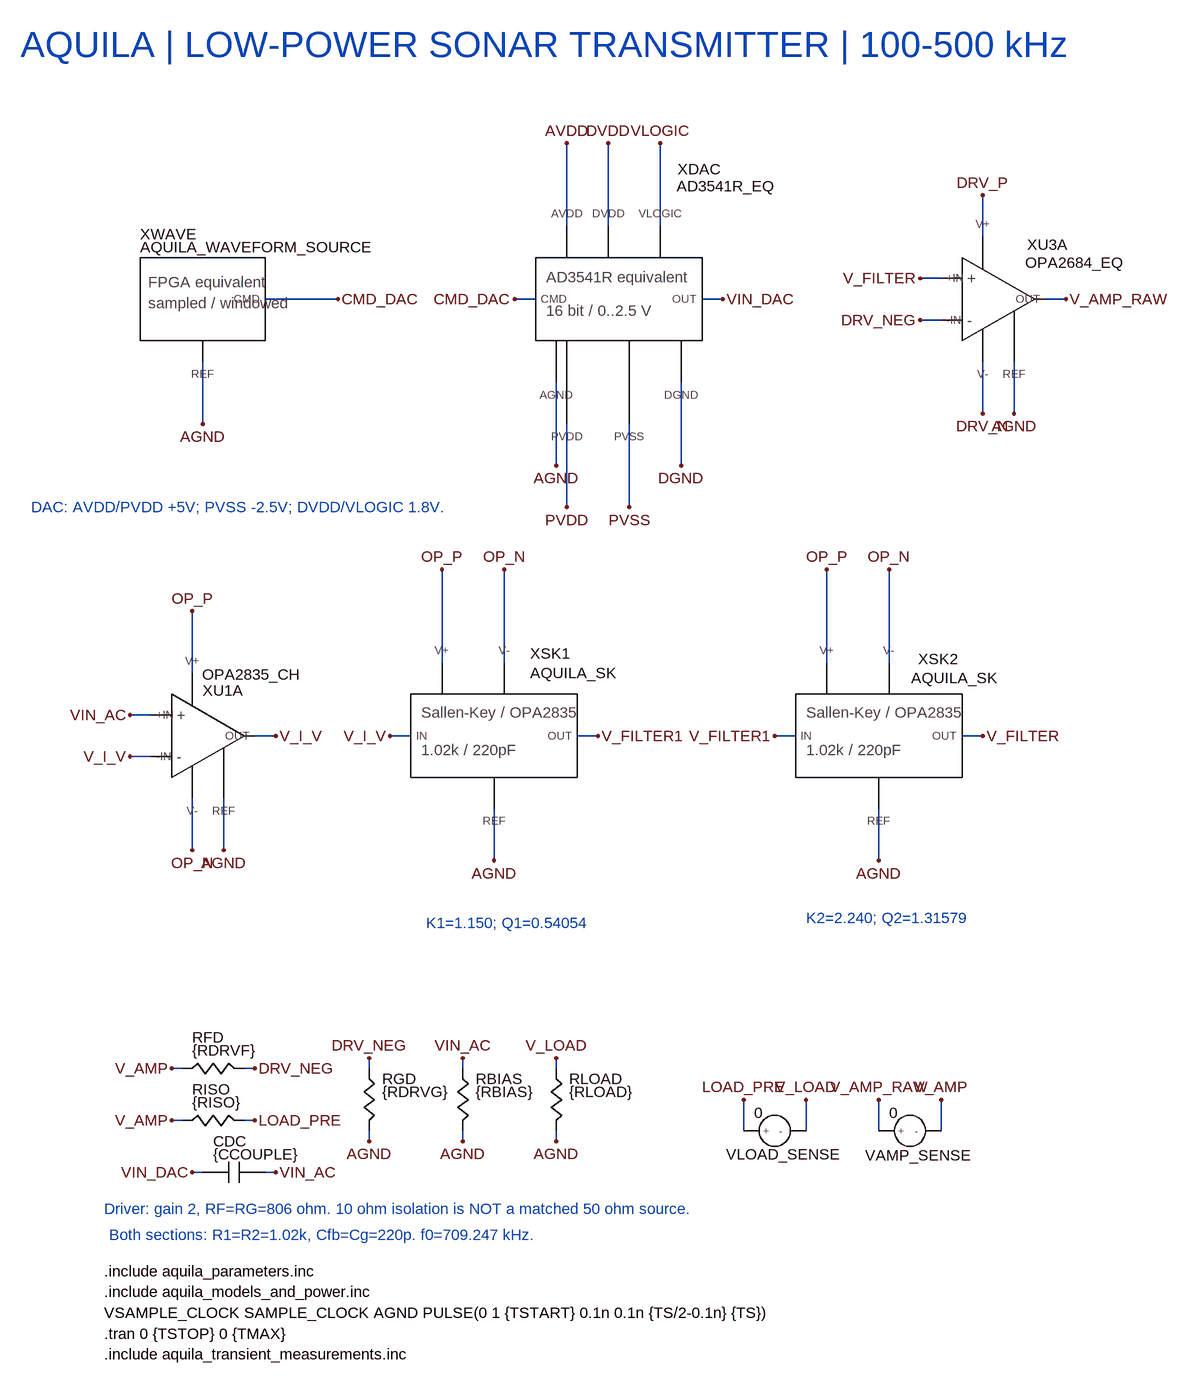
[diagram p0: schematic AQUILA_TX_ANALOG.asc]
AQUILA_TX_ANALOG.asc, the LTspice schematic file:
Version 4.1
SHEET 1 3456 1912
WIRE -80 160 -80 32
WIRE -16 160 -16 32
WIRE 64 160 64 32
WIRE 560 176 560 112
WIRE 496 240 464 240
WIRE -432 272 -544 272
WIRE -128 272 -160 272
WIRE 160 272 128 272
WIRE 688 272 656 272
WIRE 496 304 464 304
WIRE 560 448 560 368
WIRE 608 448 608 368
WIRE -640 464 -640 368
WIRE -96 528 -96 400
WIRE 96 528 96 400
WIRE -80 592 -80 464
WIRE 16 592 16 464
WIRE -272 832 -272 688
WIRE -176 832 -176 688
WIRE 320 832 320 688
WIRE 416 832 416 688
WIRE -656 848 -656 752
WIRE -720 912 -752 912
WIRE -528 944 -560 944
WIRE -320 944 -352 944
WIRE -32 944 -64 944
WIRE 272 944 240 944
WIRE 560 944 528 944
WIRE -720 976 -752 976
WIRE -656 1120 -656 1040
WIRE -608 1120 -608 1040
WIRE -192 1136 -192 1056
WIRE 400 1136 400 1056
WIRE -672 1456 -688 1456
WIRE -560 1456 -576 1456
WIRE -384 1456 -384 1440
WIRE -240 1456 -240 1440
WIRE -96 1456 -96 1440
WIRE -672 1536 -688 1536
WIRE -560 1536 -576 1536
WIRE 192 1552 192 1504
WIRE 288 1552 288 1504
WIRE 400 1552 400 1504
WIRE 496 1552 496 1504
WIRE -384 1568 -384 1552
WIRE -240 1568 -240 1552
WIRE -96 1568 -96 1552
WIRE -640 1616 -656 1616
WIRE -528 1616 -544 1616
FLAG -432 272 CMD_DAC
FLAG -640 464 AGND
FLAG -160 272 CMD_DAC
FLAG 160 272 VIN_DAC
FLAG -96 528 AGND
FLAG -80 32 AVDD
FLAG -16 32 DVDD
FLAG 64 32 VLOGIC
FLAG -80 592 PVDD
FLAG 16 592 PVSS
FLAG 96 528 DGND
FLAG -656 1616 VIN_DAC
FLAG -528 1616 VIN_AC
FLAG -240 1440 VIN_AC
FLAG -240 1568 AGND
FLAG -752 912 VIN_AC
FLAG -752 976 V_I_V
FLAG -656 752 OP_P
FLAG -656 1120 OP_N
FLAG -528 944 V_I_V
FLAG -608 1120 AGND
FLAG -352 944 V_I_V
FLAG -32 944 V_FILTER1
FLAG -272 688 OP_P
FLAG -176 688 OP_N
FLAG -192 1136 AGND
FLAG 240 944 V_FILTER1
FLAG 560 944 V_FILTER
FLAG 320 688 OP_P
FLAG 416 688 OP_N
FLAG 400 1136 AGND
FLAG 464 240 V_FILTER
FLAG 464 304 DRV_NEG
FLAG 560 112 DRV_P
FLAG 560 448 DRV_N
FLAG 688 272 V_AMP_RAW
FLAG 608 448 AGND
FLAG -688 1456 V_AMP
FLAG -560 1456 DRV_NEG
FLAG -384 1440 DRV_NEG
FLAG -384 1568 AGND
FLAG 400 1504 V_AMP_RAW
FLAG 496 1504 V_AMP
FLAG -688 1536 V_AMP
FLAG -560 1536 LOAD_PRE
FLAG 192 1504 LOAD_PRE
FLAG 288 1504 V_LOAD
FLAG -96 1440 V_LOAD
FLAG -96 1568 AGND
SYMBOL symbols\\AQUILA_WAVEFORM_SOURCE -736 208 R0
SYMATTR InstName XWAVE
SYMBOL symbols\\AD3541R -128 208 R0
WINDOW 0 219 -136 Left 2
WINDOW 3 217 -110 Left 2
SYMATTR InstName XDAC
SYMBOL symbols\\AQ_C -640 1616 R0
SYMATTR InstName CDC
SYMATTR Value {CCOUPLE}
SYMBOL symbols\\AQ_RV -240 1456 R0
SYMATTR InstName RBIAS
SYMATTR Value {RBIAS}
SYMBOL symbols\\OPA2835 -720 944 R0
WINDOW 0 80 -70 Left 2
WINDOW 3 79 -94 Left 2
SYMATTR InstName XU1A
SYMBOL symbols\\AQUILA_SK -320 880 R0
WINDOW 0 184 -63 Left 2
WINDOW 3 184 -33 Left 2
SYMATTR InstName XSK1
SYMATTR SpiceLine RF={RF1} RG={RG1}
SYMBOL symbols\\AQUILA_SK 272 880 R0
WINDOW 0 189 -54 Left 2
WINDOW 3 178 -25 Left 2
SYMATTR InstName XSK2
SYMATTR SpiceLine RF={RF2} RG={RG2}
SYMBOL symbols\\OPA2684 496 272 R0
WINDOW 0 132 -84 Left 2
WINDOW 3 129 -56 Left 2
SYMATTR InstName XU3A
SYMBOL symbols\\AQ_R -672 1456 R0
SYMATTR InstName RFD
SYMATTR Value {RDRVF}
SYMBOL symbols\\AQ_RV -384 1456 R0
SYMATTR InstName RGD
SYMATTR Value {RDRVG}
SYMBOL symbols\\AQ_V 400 1552 R0
WINDOW 0 -21 38 Left 2
SYMATTR InstName VAMP_SENSE
SYMATTR Value 0
SYMBOL symbols\\AQ_R -672 1536 R0
SYMATTR InstName RISO
SYMATTR Value {RISO}
SYMBOL symbols\\AQ_V 192 1552 R0
WINDOW 0 -27 36 Left 2
SYMATTR InstName VLOAD_SENSE
SYMATTR Value 0
SYMBOL symbols\\AQ_RV -96 1456 R0
SYMATTR InstName RLOAD
SYMATTR Value {RLOAD}
TEXT -920 -120 Left 5 ;AQUILA | LOW-POWER SONAR TRANSMITTER | 100-500 kHz
TEXT -296 1232 Left 2 ;K1=1.150; Q1=0.54054
TEXT 288 1224 Left 2 ;K2=2.240; Q2=1.31579
TEXT -784 1712 Left 2 ;Both sections: R1=R2=1.02k, Cfb=Cg=220p. f0=709.247 kHz.
TEXT -792 1672 Left 2 ;Driver: gain 2, RF=RG=806 ohm. 10 ohm isolation is NOT a matched 50 ohm source.
TEXT -904 592 Left 2 ;DAC: AVDD/PVDD +5V; PVSS -2.5V; DVDD/VLOGIC 1.8V.
TEXT -792 1768 Left 2 !.include aquila_parameters.inc
TEXT -792 1800 Left 2 !.include aquila_models_and_power.inc
TEXT -792 1832 Left 2 !VSAMPLE_CLOCK SAMPLE_CLOCK AGND PULSE(0 1 {TSTART} 0.1n 0.1n {TS/2-0.1n} {TS})
TEXT -792 1864 Left 2 !.tran 0 {TSTOP} 0 {TMAX}
TEXT -792 1896 Left 2 !.include aquila_transient_measurements.inc

The netlist it stands for:
* AQUILA_TX_ANALOG.asc
X§XWAVE CMD_DAC AGND AQUILA_WAVEFORM_SOURCE  ; pins CMD REF
X§XDAC CMD_DAC VIN_DAC AGND AVDD DVDD VLOGIC PVDD PVSS DGND AD3541R_EQ  ; pins CMD OUT AGND AVDD DVDD VLOGIC PVDD PVSS DGND
CDC VIN_DAC VIN_AC {CCOUPLE}
RBIAS VIN_AC AGND {RBIAS}
X§XU1A VIN_AC V_I_V OP_P OP_N V_I_V AGND OPA2835_CH  ; pins +IN -IN V+ V- OUT REF
X§XSK1 V_I_V V_FILTER1 OP_P OP_N AGND AQUILA_SK RF={RF1} RG={RG1}  ; pins IN OUT V+ V- REF
X§XSK2 V_FILTER1 V_FILTER OP_P OP_N AGND AQUILA_SK RF={RF2} RG={RG2}  ; pins IN OUT V+ V- REF
X§XU3A V_FILTER DRV_NEG DRV_P DRV_N V_AMP_RAW AGND OPA2684_EQ  ; pins +IN -IN V+ V- OUT REF
RFD V_AMP DRV_NEG {RDRVF}
RGD DRV_NEG AGND {RDRVG}
VAMP_SENSE V_AMP_RAW V_AMP 0
RISO V_AMP LOAD_PRE {RISO}
VLOAD_SENSE LOAD_PRE V_LOAD 0
RLOAD V_LOAD AGND {RLOAD}
* AQUILA | LOW-POWER SONAR TRANSMITTER | 100-500 kHz
* K1=1.150; Q1=0.54054
* K2=2.240; Q2=1.31579
* Both sections: R1=R2=1.02k, Cfb=Cg=220p. f0=709.247 kHz.
* Driver: gain 2, RF=RG=806 ohm. 10 ohm isolation is NOT a matched 50 ohm source.
* DAC: AVDD/PVDD +5V; PVSS -2.5V; DVDD/VLOGIC 1.8V.
.include aquila_parameters.inc
.include aquila_models_and_power.inc
VSAMPLE_CLOCK SAMPLE_CLOCK AGND PULSE(0 1 {TSTART} 0.1n 0.1n {TS/2-0.1n} {TS})
.tran 0 {TSTOP} 0 {TMAX}
.include aquila_transient_measurements.inc
.backanno
.end